# Altium schematic sheet MCU.SchDoc: MCU
size 420 x 297 mm; SheetNumber: 11; SheetTotal: 11
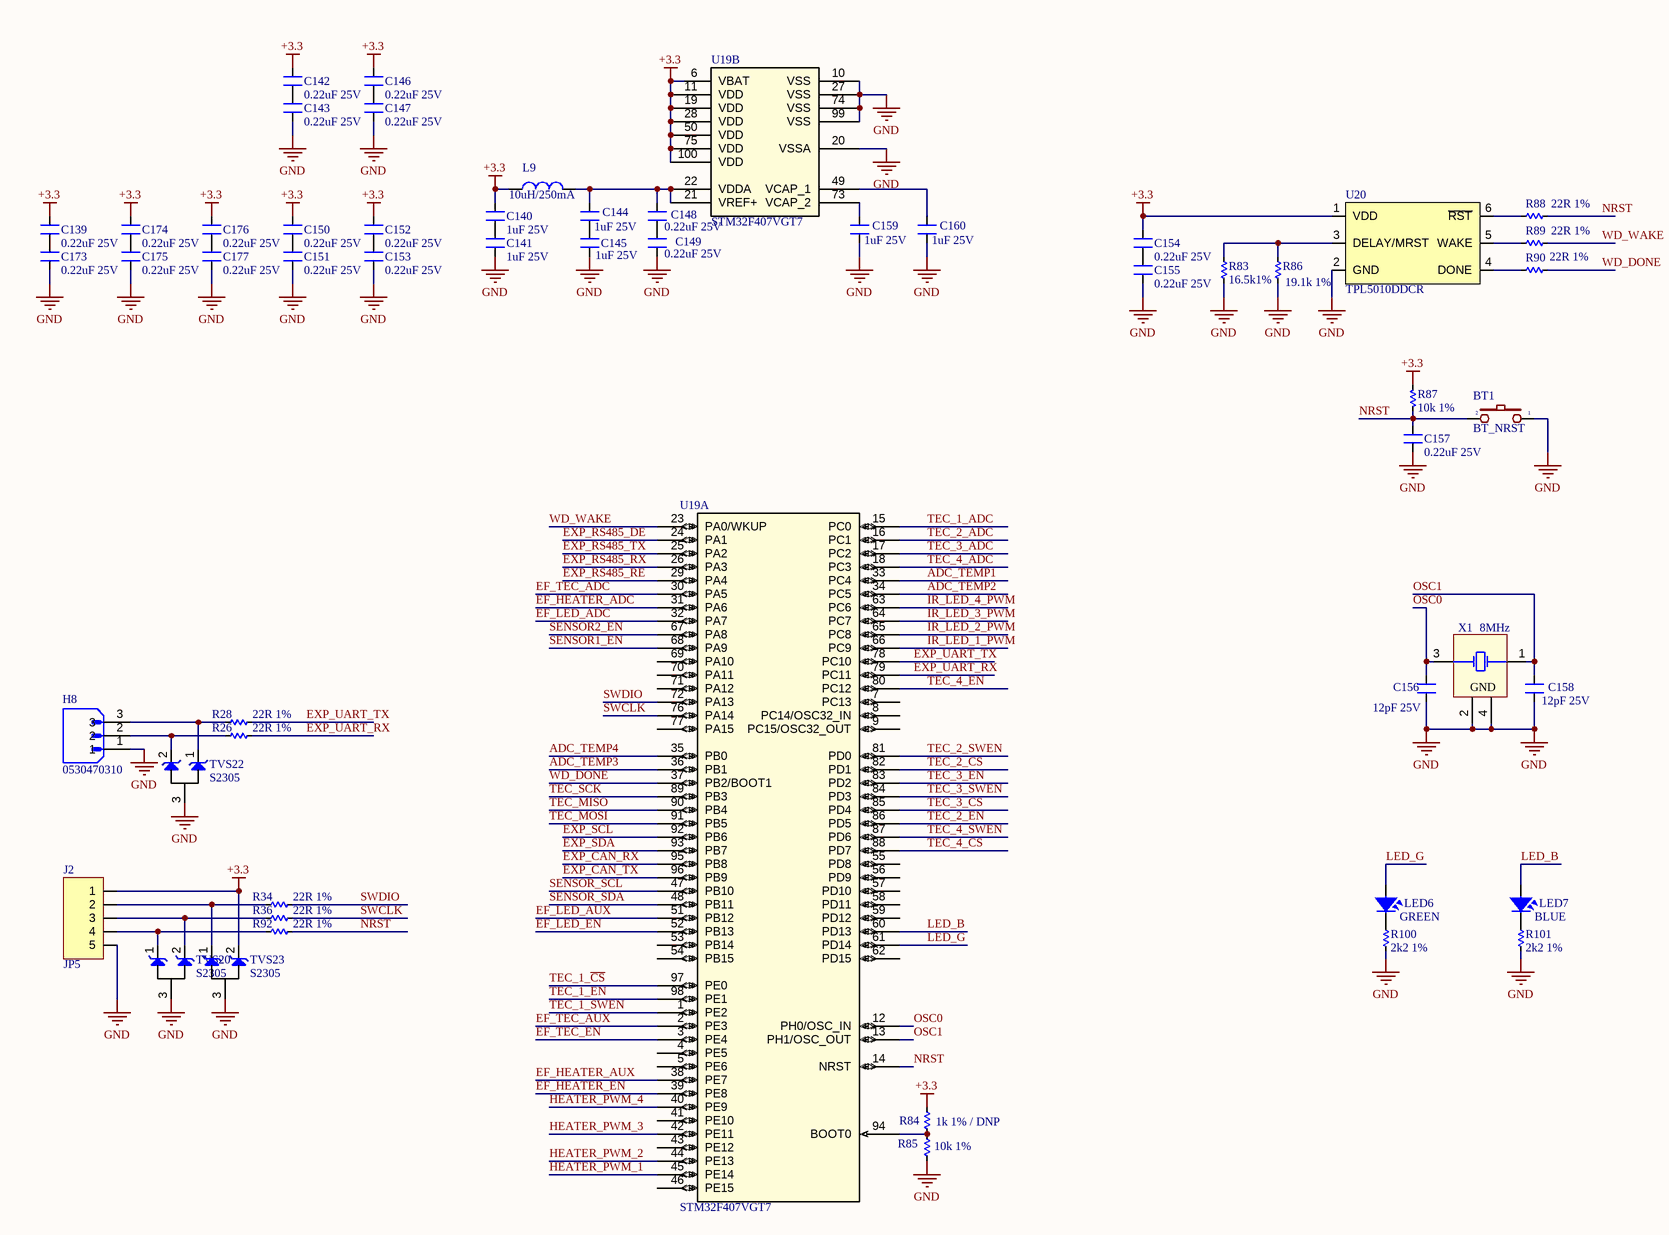
[diagram p0: MCU.SchDoc]

## Parts
BT1  BT_NRST  [SW1-SMD]
C139  0.22uF 25V  [CN-SMD-0603]
C140  1uF 25V  [CN-SMD-0603]
C141  1uF 25V  [CN-SMD-0603]
C142  0.22uF 25V  [CN-SMD-0603]
C143  0.22uF 25V  [CN-SMD-0603]
C144  1uF 25V  [CN-SMD-0603]
C145  1uF 25V  [CN-SMD-0603]
C146  0.22uF 25V  [CN-SMD-0603]
C147  0.22uF 25V  [CN-SMD-0603]
C148  0.22uF 25V  [CN-SMD-0603]
C149  0.22uF 25V  [CN-SMD-0603]
C150  0.22uF 25V  [CN-SMD-0603]
C151  0.22uF 25V  [CN-SMD-0603]
C152  0.22uF 25V  [CN-SMD-0603]
C153  0.22uF 25V  [CN-SMD-0603]
C154  0.22uF 25V  [CN-SMD-0603]
C155  0.22uF 25V  [CN-SMD-0603]
C156  12pF 25V  [CN-SMD-0603]
C157  0.22uF 25V  [CN-SMD-0603]
C158  12pF 25V  [CN-SMD-0603]
C159  1uF 25V  [CN-SMD-0603]
C160  1uF 25V  [CN-SMD-0603]
C173  0.22uF 25V  [CN-SMD-0603]
C174  0.22uF 25V  [CN-SMD-0603]
C175  0.22uF 25V  [CN-SMD-0603]
C176  0.22uF 25V  [CN-SMD-0603]
C177  0.22uF 25V  [CN-SMD-0603]
H8  0530470310  [0530470310]
J2  JP5  [JP5-D1T]
L9  10uH/250mA  [L-SMD-0603]
LED6  GREEN  [LED_0603_RED]
LED7  BLUE  [LED_0603_RED]
R26  22R 1%  [RES-SMD-0603]
R28  22R 1%  [RES-SMD-0603]
R34  22R 1%  [RES-SMD-0603]
R36  22R 1%  [RES-SMD-0603]
R83  16.5k1%  [RES-SMD-0603]
R84  1k 1% / DNP  [RES-SMD-0603]
R85  10k 1%  [RES-SMD-0603]
R86  19.1k 1%  [RES-SMD-0603]
R87  10k 1%  [RES-SMD-0603]
R88  22R 1%  [RES-SMD-0603]
R89  22R 1%  [RES-SMD-0603]
R90  22R 1%  [RES-SMD-0603]
R92  22R 1%  [RES-SMD-0603]
R100  2k2 1%  [RES-SMD-0603]
R101  2k2 1%  [RES-SMD-0603]
TVS20  S2305  [sot23-12_3]
TVS22  S2305  [sot23-12_3]
TVS23  S2305  [sot23-12_3]
U19  STM32F407VGT7  [LQFP-100]  (parts A,B of 2)
U20  TPL5010DDCR  [SOT23-6-123_456]
X1  8MHz  [XT4-16.000MHz-4_V]

## Nets
+3.3: C139.2 C140.2 C142.2 C146.2 C150.2 C152.2 C154.2 C174.2 C176.2 J2.1 L9.1 R84.1 R87.1 TVS23.2 U19.6(VBAT) U19.11(VDD) U19.19(VDD) U19.28(VDD) U19.50(VDD) U19.75(VDD) U19.100(VDD) U20.1(VDD)
GND: BT1.1 C141.1 C143.1 C145.1 C147.1 C149.1 C151.1 C153.1 C155.1 C156.2 C157.1 C158.1 C159.1 C160.1 C173.1 C175.1 C177.1 H8.1 J2.5 R83.1 R85.2 R86.1 R100.2 R101.2 TVS20.3 TVS22.3 TVS23.3 U19.10(VSS) U19.20(VSSA) U19.27(VSS) U19.74(VSS) U19.99(VSS) U20.2(GND) X1.2(GND) X1.4(GND)
ADC_TEMP1: U19.33(PC4)
ADC_TEMP2: U19.34(PC5)
ADC_TEMP3: U19.36(PB1)
ADC_TEMP4: U19.35(PB0)
EF_HEATER_ADC: U19.31(PA6)
EF_HEATER_AUX: U19.38(PE7)
EF_HEATER_EN: U19.39(PE8)
EF_LED_ADC: U19.32(PA7)
EF_LED_AUX: U19.51(PB12)
EF_LED_EN: U19.52(PB13)
EF_TEC_ADC: U19.30(PA5)
EF_TEC_AUX: U19.2(PE3)
EF_TEC_EN: U19.3(PE4)
EXP_CAN_RX: U19.95(PB8)
EXP_CAN_TX: U19.96(PB9)
EXP_RS485_DE: U19.24(PA1)
EXP_RS485_~{RE}: U19.29(PA4)
EXP_RS485_RX: U19.26(PA3)
EXP_RS485_TX: U19.25(PA2)
EXP_SCL: U19.92(PB6)
EXP_SDA: U19.93(PB7)
EXP_UART_RX: R26.1 U19.79(PC11)
EXP_UART_TX: R28.1 U19.78(PC10)
HEATER_PWM_1: U19.45(PE14)
HEATER_PWM_2: U19.44(PE13)
HEATER_PWM_3: U19.42(PE11)
HEATER_PWM_4: U19.40(PE9)
IR_LED_1_PWM: U19.66(PC9)
IR_LED_2_PWM: U19.65(PC8)
IR_LED_3_PWM: U19.64(PC7)
IR_LED_4_PWM: U19.63(PC6)
LED_B: LED7.1 U19.60(PD13)
LED_G: LED6.1 U19.61(PD14)
NRST: BT1.2 C157.2 R87.2 R88.2 R92.1 U19.14(NRST)
OSC0: C156.1 U19.12(PH0/OSC_IN) X1.3(XTAL)
OSC1: C158.2 U19.13(PH1/OSC_OUT) X1.1(XTAL)
SENSOR1_EN: U19.68(PA9)
SENSOR2_EN: U19.67(PA8)
SENSOR_SCL: U19.47(PB10)
SENSOR_SDA: U19.48(PB11)
SWCLK: R36.1 U19.76(PA14)
SWDIO: R34.1 U19.72(PA13)
TEC_1_ADC: U19.15(PC0)
TEC_1_~{CS}: U19.97(PE0)
TEC_1_EN: U19.98(PE1)
TEC_1_SWEN: U19.1(PE2)
TEC_2_ADC: U19.16(PC1)
TEC_2_~{CS}: U19.82(PD1)
TEC_2_EN: U19.86(PD5)
TEC_2_SWEN: U19.81(PD0)
TEC_3_ADC: U19.17(PC2)
TEC_3_~{CS}: U19.85(PD4)
TEC_3_EN: U19.83(PD2)
TEC_3_SWEN: U19.84(PD3)
TEC_4_ADC: U19.18(PC3)
TEC_4_~{CS}: U19.88(PD7)
TEC_4_EN: U19.80(PC12)
TEC_4_SWEN: U19.87(PD6)
TEC_MISO: U19.90(PB4)
TEC_MOSI: U19.91(PB5)
TEC_SCK: U19.89(PB3)
WD_DONE: R90.2 U19.37(PB2/BOOT1)
WD_WAKE: R89.2 U19.23(PA0/WKUP)
NetC139_1: C139.1 C173.2
NetC140_1: C140.1 C141.2
NetC142_1: C142.1 C143.2
NetC144_1: C144.1 C145.2
NetC144_2: C144.2 C148.2 L9.2 U19.21(VREF+) U19.22(VDDA)
NetC146_1: C146.1 C147.2
NetC148_1: C148.1 C149.2
NetC150_1: C150.1 C151.2
NetC152_1: C152.1 C153.2
NetC154_1: C154.1 C155.2
NetC159_2: C159.2 U19.73(VCAP_2)
NetC160_2: C160.2 U19.49(VCAP_1)
NetC174_1: C174.1 C175.2
NetC176_1: C176.1 C177.2
NetH8_2: H8.2 R26.2 TVS22.2
NetH8_3: H8.3 R28.2 TVS22.1
NetJ2_2: J2.2 R34.2 TVS23.1
NetJ2_3: J2.3 R36.2 TVS20.2
NetJ2_4: J2.4 R92.2 TVS20.1
NetLED6_2: LED6.2 R100.1
NetLED7_2: LED7.2 R101.1
NetR83_2: R83.2 R86.2 U20.3(DELAY/MRST)
NetR84_2: R84.2 R85.1 U19.94(BOOT0)
NetR88_1: R88.1 U20.6(~{RST})
NetR89_1: R89.1 U20.5(WAKE)
NetR90_1: R90.1 U20.4(DONE)

Not connected (* = marked no-connect by the designer): U19 4(PE5) 5(PE6) 7(PC13) 8(PC14/OSC32_IN) 9(PC15/OSC32_OUT) 41(PE10) 43(PE12) 46(PE15) 53(PB14) 54(PB15) 55(PD8) 56(PD9) 57(PD10) 58(PD11) 59(PD12) 62(PD15) 69(PA10) 70(PA11) 71(PA12) 77(PA15)

## Notes on the sheet
- Project:
- BEE-PC1
- Sub-system:
- NANORACK_EXP_CONTROLLER
- Design by:
- SANG HUYNH
- BAO BUI Q.
- Sheet title:
- Sheet
- A3
- of
- Checked by:
- Approved by:
- VU PHAM
- Revision:
- Document No:
- V1.0.0
- Size:
- Date:
- 01/10/2024

## Library data of the parts
BT1 = SW2: Switch button 2 pin; Value: SW chip 2 pin
C139-C160 C173-C177 = Capacitors: Value: 33pF
H8 = 0530470310: CONN HEADER VERT 3POS 1.25MM
J2 = JP5: WR-PHD 2.54 mm Angled Socket Header; Manufacturer: W¨¹rth Elektronik eiSos GmbH; partNo: 613005143121; ComponentLink1 Description: Manufacturer; ComponentLink2 Description: Datasheet; NoPins: 05; Created Date: 29 March 2013; ComponentLink1URL: http://www.we-online.com; ComponentLink2URL: http://katalog.we-online.de/em/datasheet/6130xx143121.pdf; Created by: Karrer Zheng
L9 = L-SMD-1: partNo: 78477010; Manufacturer: Wurth Elektronik; Inductance: 1.0 μH; ComponentLink1Description: Manufacturer; ComponentLink1URL: http://www.we-online.de; Created by: Baojun Chen; Created Date: Nov.2015; ComponentLink2Description: Datasheet; ComponentLink2URL: http://katalog.we-online.de/pbs/datasheet/78477010.pdf
LED6 LED7 = LED SMD: Value: LED 3 - 5 ly 2 Colour
R26 R28 R34 R36 R83-R90 R92 R100 R101 = Res SMD: SMD; Manufacturer: Generic Components; Class: Passive; Published: 08/06/2000; Publisher: Altium Hobart Technology Centre
TVS20 TVS22 TVS23 = S2305: TVS DIODE 5VWM 10.8VC SOT23
U19 = STM32F407VGT7: ARM® Cortex®-M4 STM32F4 Microcontroller IC 32-Bit Single-Core 168MHz 1MB (1M x 8) FLASH 100-LQFP (14x14)
U20 = TPL5010DDCR: IC OSC PROG TIMER TSOT23-6
X1 = XT4: Crystal, 8 MHz, -30 to 85 degC, 3.2 x 2.5 x 0.9 mm SMD; Value: 4Mhz